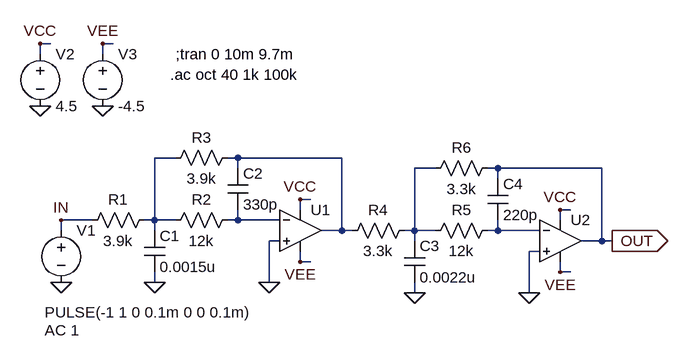
[diagram p0: schematic Nucleo_DCO_LFO_MFB_4th_Bessel_25kHz@10kHzSaw.asc]
Nucleo_DCO_LFO_MFB_4th_Bessel_25kHz@10kHzSaw.asc, the LTspice schematic file:
Version 4
SHEET 1 1156 680
WIRE 176 -240 160 -240
WIRE 272 -240 256 -240
WIRE 160 -224 160 -240
WIRE 256 -224 256 -240
WIRE 368 -64 336 -64
WIRE 464 -64 448 -64
WIRE 624 -64 464 -64
WIRE 464 -48 464 -64
WIRE 768 -48 736 -48
WIRE 864 -48 848 -48
WIRE 1024 -48 864 -48
WIRE 864 -32 864 -48
WIRE 576 0 560 0
WIRE 560 16 560 0
WIRE 976 16 960 16
WIRE 240 32 192 32
WIRE 336 32 336 -64
WIRE 336 32 320 32
WIRE 368 32 336 32
WIRE 464 32 464 16
WIRE 464 32 448 32
WIRE 528 32 464 32
WIRE 960 32 960 16
WIRE 192 48 192 32
WIRE 336 48 336 32
WIRE 624 48 624 -64
WIRE 624 48 592 48
WIRE 640 48 624 48
WIRE 736 48 736 -48
WIRE 736 48 720 48
WIRE 768 48 736 48
WIRE 864 48 864 32
WIRE 864 48 848 48
WIRE 928 48 864 48
WIRE 528 64 512 64
WIRE 736 64 736 48
WIRE 1024 64 1024 -48
WIRE 1024 64 992 64
WIRE 1040 64 1024 64
WIRE 928 80 912 80
WIRE 560 96 560 80
WIRE 576 96 560 96
WIRE 960 112 960 96
WIRE 976 112 960 112
WIRE 336 128 336 112
WIRE 512 128 512 64
WIRE 736 144 736 128
WIRE 912 144 912 80
FLAG 336 128 0
FLAG 512 128 0
FLAG 560 0 VCC
FLAG 560 96 VEE
FLAG 736 144 0
FLAG 912 144 0
FLAG 960 16 VCC
FLAG 960 112 VEE
FLAG 192 128 0
FLAG 160 -144 0
FLAG 256 -144 0
FLAG 160 -240 VCC
FLAG 256 -240 VEE
FLAG 1040 64 OUT
IOPIN 1040 64 Out
FLAG 192 32 IN
SYMBOL voltage 192 32 R0
WINDOW 3 -25 142 Left 2
WINDOW 123 -25 170 Left 2
WINDOW 39 0 0 Left 2
SYMATTR Value PULSE(-1 1 0 0.1m 0 0 0.1m)
SYMATTR Value2 AC 1
SYMATTR InstName V1
SYMBOL res 336 16 R90
WINDOW 0 0 56 VBottom 2
WINDOW 3 32 56 VTop 2
SYMATTR InstName R1
SYMATTR Value 3.9k
SYMBOL res 464 16 R90
WINDOW 0 0 56 VBottom 2
WINDOW 3 32 56 VTop 2
SYMATTR InstName R2
SYMATTR Value 12k
SYMBOL res 464 -80 R90
WINDOW 0 0 56 VBottom 2
WINDOW 3 32 56 VTop 2
SYMATTR InstName R3
SYMATTR Value 3.9k
SYMBOL cap 320 48 R0
SYMATTR InstName C1
SYMATTR Value 0.0015u
SYMBOL cap 448 -48 R0
SYMATTR InstName C2
SYMATTR Value 330p
SYMBOL Opamps\\UniversalOpamp2 560 48 R0
SYMATTR InstName U1
SYMBOL res 736 32 R90
WINDOW 0 0 56 VBottom 2
WINDOW 3 32 56 VTop 2
SYMATTR InstName R4
SYMATTR Value 3.3k
SYMBOL res 864 32 R90
WINDOW 0 0 56 VBottom 2
WINDOW 3 32 56 VTop 2
SYMATTR InstName R5
SYMATTR Value 12k
SYMBOL res 864 -64 R90
WINDOW 0 0 56 VBottom 2
WINDOW 3 32 56 VTop 2
SYMATTR InstName R6
SYMATTR Value 3.3k
SYMBOL cap 720 64 R0
SYMATTR InstName C3
SYMATTR Value 0.0022u
SYMBOL cap 848 -32 R0
SYMATTR InstName C4
SYMATTR Value 220p
SYMBOL Opamps\\UniversalOpamp2 960 64 R0
SYMATTR InstName U2
SYMBOL voltage 160 -240 R0
WINDOW 123 0 0 Left 2
WINDOW 39 0 0 Left 2
SYMATTR InstName V2
SYMATTR Value 4.5
SYMBOL voltage 256 -240 R0
WINDOW 123 0 0 Left 2
WINDOW 39 0 0 Left 2
SYMATTR InstName V3
SYMATTR Value -4.5
TEXT 368 -224 Left 2 !;tran 0 10m 9.7m
TEXT 360 -192 Left 2 !.ac oct 40 1k 100k

The netlist it stands for:
* Nucleo_DCO_LFO_MFB_4th_Bessel_25kHz@10kHzSaw.asc
V1 IN 0 PULSE(-1 1 0 0.1m 0 0 0.1m) AC 1
R1 N001 IN 3.9k
R2 N004 N001 12k
R3 N002 N001 3.9k
C1 N001 0 0.0015u
C2 N002 N004 330p
XU1 0 N004 VCC VEE N002 level.2 Avol=1Meg GBW=10Meg Slew=10Meg ilimit=25m rail=0 Vos=0 phimargin=45 en=0 enk=0 in=0 ink=0 Rin=500Meg  ; pins IN+ IN- V+ V- OUT
R4 N003 N002 3.3k
R5 N005 N003 12k
R6 OUT N003 3.3k
C3 N003 0 0.0022u
C4 OUT N005 220p
XU2 0 N005 VCC VEE OUT level.2 Avol=1Meg GBW=10Meg Slew=10Meg ilimit=25m rail=0 Vos=0 phimargin=45 en=0 enk=0 in=0 ink=0 Rin=500Meg  ; pins IN+ IN- V+ V- OUT
V2 VCC 0 4.5
V3 VEE 0 -4.5
;tran 0 10m 9.7m
.ac oct 40 1k 100k
.lib UniversalOpamps2.sub
.backanno
.end